# Altium schematic sheet MCU.SchDoc: =ProjectTitle
size 297 x 209 mm; Address1: Address1; Address2: Address2; Address3: Address3; Address4: Address4; SheetNumber: ?; SheetTotal: ?; Scale: 1:1; DocumentType: Схема электрическая принципиальная; Title2str: ?
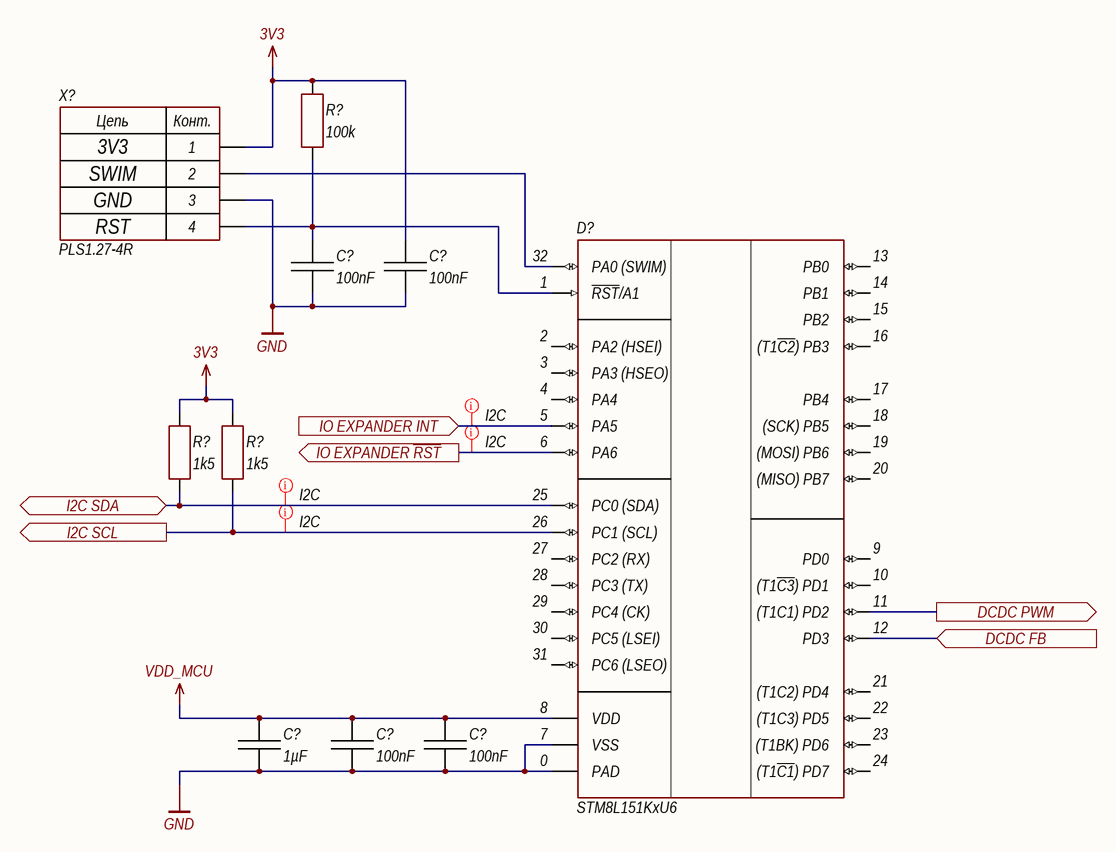
[diagram p0: MCU.SchDoc]

## Parts
(Parts that share a designator on the sheet are numbered #1, #2 ... from top to bottom, then left to right.)
C?#1  100nF  [CH0402C]
C?#2  100nF  [CH0402C]
C?#3  1µF  [CH0402C]
C?#4  100nF  [CH0402C]
C?#5  100nF  [CH0402C]
D?  STM8L151KxU6  [32-UFQFPN]
R?#1  100k  [CH0402R]
R?#2  1k5  [CH0402R]
R?#3  1k5  [CH0402R]
X?  PLS1.27-4R  [CON: PLS1.27-4R]

## Ports
DCDC FB (in), DCDC PWM (out), I2C SCL (out), I2C SDA (bidir), IO EXPANDER INT (in), IO EXPANDER ~{RST} (out)

## Nets
3V3: C?#2.2 R?#1.2 R?#2.2 R?#3.2 X?.1
GND: C?#1.1 C?#2.1 C?#3.1 C?#4.1 C?#5.1 D?.0(PAD) D?.7(VSS) X?.3
VDD_MCU: C?#3.2 C?#4.2 C?#5.2 D?.8(VDD)
DCDC FB: D?.12(PD3) ; port DCDC FB
DCDC PWM: D?.11((T1C1)_PD2) ; port DCDC PWM
I2C SCL: D?.26(PC1_(SCL)) R?#3.1 ; port I2C SCL
I2C SDA: D?.25(PC0_(SDA)) R?#2.1 ; port I2C SDA
IO EXPANDER INT: D?.5(PA5) ; port IO EXPANDER INT
IO EXPANDER ~{RST}: D?.6(PA6) ; port IO EXPANDER ~{RST}
NetC?#1_2: C?#1.2 D?.1(~{RST}/A1) R?#1.1 X?.4
NetD?_32: D?.32(PA0_(SWIM)) X?.2

Not connected (* = marked no-connect by the designer): D? 2(PA2_(HSEI)) 3(PA3_(HSEO)) 4(PA4) 9(PD0) 10((T1~{C3})_PD1) 13(PB0) 14(PB1) 15(PB2) 16((T1~{C2})_PB3) 17(PB4) 18((SCK)_PB5) 19((MOSI)_PB6) 20((MISO)_PB7) 21((T1C2)_PD4) 22((T1C3)_PD5) 23((T1BK)_PD6) 24((T1~{C1})_PD7) 27(PC2_(RX)) 28(PC3_(TX)) 29(PC4_(CK)) 30(PC5_(LSEI)) 31(PC6_(LSEO))

## Layout directives
net class I2C; rule Matched Net Lengths [Tolerance = 0.1mm]: I2C SCL, I2C SDA, IO EXPANDER INT
net class I2C: IO EXPANDER ~{RST}

## Notes on the sheet
- 3V3
- SWIM
- GND
- RST
- Утв.
- Н.контр.
- Т.контр.
- Пров.
- Разраб.
- Изм.
- Лист
- № докум.
- Подп.
- Дата
- Копировал
- Формат А4
- Лит.
- Листов
- Масса
- Масштаб
- (in symbol 4-Connector) Цепь; Конт.

## Library data of the parts
C?#1 C?#2 C?#4 C?#5 = Capacitor: Manufacturer: CCTC; Model: TCC0402X7R104K250AT; HelpURL: https://lcsc.com/product-detail/Multilayer-Ceramic-Capacitors-MLCC-SMD-SMT_CCTC-TCC0402X7R104K250AT_C466234.html; ComponentKind: X7R, 50V; Value: 100nF
C?#3 = Capacitor: Manufacturer: Samsung Electro-Mechanics; Model: CL05B105KQ5NQNC; HelpURL: https://lcsc.com/product-detail/Others_Samsung-Electro-Mechanics_CL05B105KQ5NQNC_Samsung-Electro-Mechanics-CL05B105KQ5NQNC_C307427.html; ComponentKind: X7R, 6.3V; Value: 1µF
D? = STM8L151KxU6: STM8; Manufacturer: ST Microelectronics; Model: STM8L151KxU6; ComponentKind: 1.8-3.6V, UFQFPN32; HelpURL: https://ru.mouser.com/datasheet/2/389/stm8l151c4-956418.pdf
R?#1 = Resistor: Manufacturer: Uniroyal Elec; Model: 0402WGF1003TCE; HelpURL: https://lcsc.com/product-detail/Chip-Resistor-Surface-Mount_UNI-ROYAL-Uniroyal-Elec-0402WGF1003TCE_C25741.html; ComponentKind: ±1%; Value: 100k
R?#2 R?#3 = Resistor: ComponentKind: ±1%; Value: 1k5
X? = 4-Connector: Model: PLS1.27-4R; Manufacturer: *; HelpURL: *; ComponentKind: *